# Altium project BatGPSTracker.PrjPcb
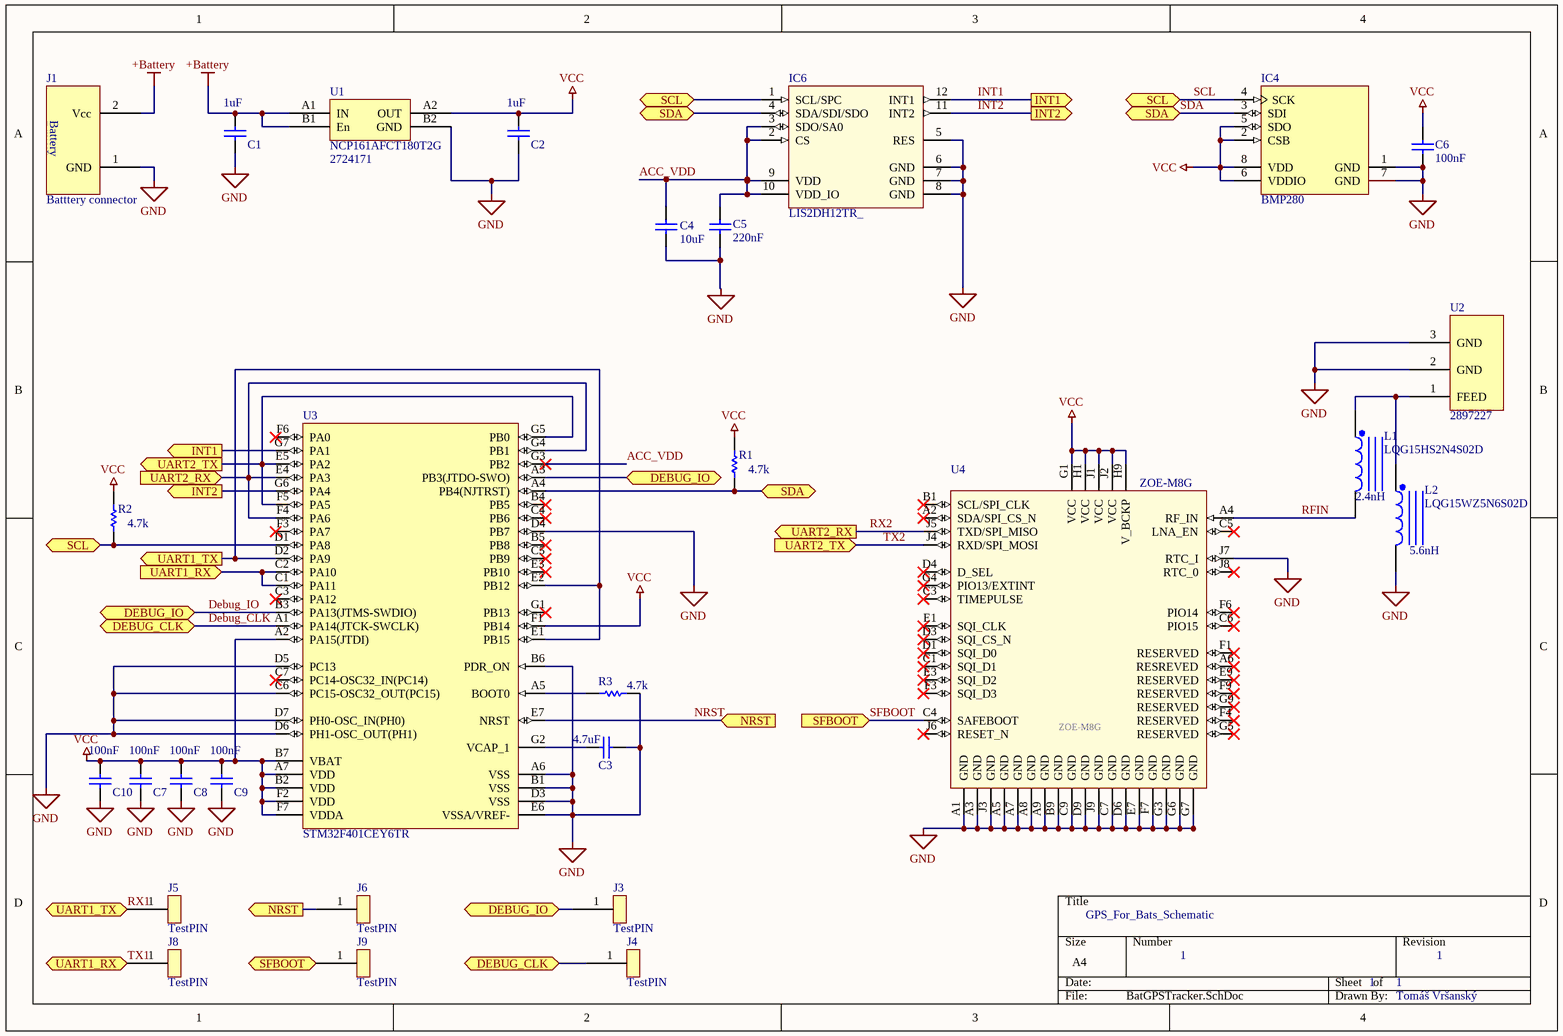
[diagram p0: BatGPSTracker.SchDoc]
projectRevision: 1
1 sheet, 28 parts. Net scope: flat (ports and power ports of the same name join across sheets).

## Sheet BatGPSTracker.SchDoc: GPS_For_Bats_Schematic
size A4; DrawnBy: Tomáš Vršanský; DocumentNumber: 1; Revision: 1; SheetNumber: 1; SheetTotal: 1; DocumentName: BatGPSTracker_Schematic; ProjectName: BatGPSTracker_Schematic

### Parts
C1  value 1uF  [CAPC0402(1005)60_L]  (hidden comment: CAP 1uF 10V 0402(1005))
C2  value 1uF  [CAPC0402(1005)60_L]  (hidden comment: CAP 1uF 10V 0402(1005))
C3  value 4.7uF  [CAPC0402(1005)60_L]  (hidden comment: CAP 4.7uF 16V 0402(1005))
C4  value 10uF  [CAPC0402(1005)60_L]  (hidden comment: CAP 10uF 6.3V 0402(1005))
C5  value 220nF  [CAPC0402(1005)60_L]  (hidden comment: CAP 220nF 6.3V 0402(1005))
C6  value 100nF  [CAPC0402(1005)60_L]  (hidden comment: CAP 100nF 25V 0402(1005))
C7  value 100nF  [CAPC0402(1005)60_L]  (hidden comment: CAP 100nF 10V 0402(1005))
C8  value 100nF  [CAPC0402(1005)60_L]  (hidden comment: CAP 100nF 10V 0402(1005))
C9  value 100nF  [CAPC0402(1005)60_L]  (hidden comment: CAP 100nF 10V 0402(1005))
C10  value 100nF  [CAPC0402(1005)60_L]  (hidden comment: CAP 100nF 10V 0402(1005))
IC4  BMP280  [BOSC-LGA-8_V]
IC6  LIS2DH12TR_  [LGA-12_]
J1  Batttery connector  [PCBCOMPONENT_1]  (no BOM)
J3  TestPIN  (no BOM)
J4  TestPIN  (no BOM)
J5  TestPIN  (no BOM)
J6  TestPIN  (no BOM)
J8  TestPIN  (no BOM)
J9  TestPIN  (no BOM)
L1  LQG15HS2N4S02D  Inductance: 2.4nH  [INDC1005X55X25ML05T10_A]
L2  LQG15WZ5N6S02D  Inductance: 5.6nH  [INDC1005X55X25ML05T10_A]
R1  Resistance (Ohms): 4.7k  [RESC1005X40X25LL10T15]  (hidden comment: RMCF0402JT4K70)
R2  Resistance (Ohms): 4.7k  [RESC1005X40X25LL10T15]  (hidden comment: RMCF0402JT4K70)
R3  Resistance (Ohms): 4.7k  [RESC1005X40X25LL10T15]  (hidden comment: RMCF0402JT4K70)
U1  NCP161AFCT180T2G  Supplier Part Number 1: 2724171  [BGA4C40P2X2_84X84X60N]
U2  Supplier Part Number 1: 2897227  [W3011]  (hidden comment: W3011)
U3  STM32F401CEY6TR  [STM-WLCSP49-3060X3060DE_V]
U4  ZOE-M8G  [ZOE-M8_ZOE-M8G(Primary)]

### Ports
DEBUG_CLK (bidir), DEBUG_IO (bidir), INT1 (out), INT2 (out), NRST (in), NRST (out), SCL (bidir), SDA (bidir), SFBOOT (in), SFBOOT (out), UART1_RX (in), UART1_RX (out), UART1_TX (in), UART1_TX (out), UART2_RX (in), UART2_RX (out), UART2_TX (in), UART2_TX (out)

### Nets
+Battery: C1.2 J1.2(Vcc) U1.A1(IN) U1.B1(En)
GND: C1.1 C2.1 C3.2 C4.1 C5.1 C6.1 C7.1 C8.1 C9.1 C10.1 IC4.1(GND) IC4.7(GND) IC6.5(RES) IC6.6(GND) IC6.7(GND) IC6.8(GND) J1.1(GND) L2.2 R3.1 U1.B2(GND) U2.2(GND) U2.3(GND) U3.A6(VSS) U3.B1(VSS) U3.B6(PDR_ON) U3.C6(PC15-OSC32_OUT(PC15)) U3.D3(VSS) U3.D4(PB7) U3.D5(PC13) U3.D6(PH1-OSC_OUT(PH1)) U3.D7(PH0-OSC_IN(PH0)) U3.E6(VSSA/VREF-) U4.A1(GND) U4.A3(GND) U4.A5(GND) U4.A7(GND) U4.A8(GND) U4.A9(GND) U4.B9(GND) U4.C7(GND) U4.C9(GND) U4.D6(GND) U4.D9(GND) U4.E7(GND) U4.F7(GND) U4.G3(GND) U4.G6(GND) U4.G7(GND) U4.J3(GND) U4.J7(RTC_I) U4.J9(GND)
VCC: C2.2 C6.2 C7.2 C8.2 C9.2 C10.2 IC4.2(CSB) IC4.5(SDO) IC4.6(VDDIO) IC4.8(VDD) R1.2 R2.2 U1.A2(OUT) U3.A2(PA15(JTDI)) U3.A7(VDD) U3.B2(VDD) U3.B7(VBAT) U3.F1(PB14) U3.F2(VDD) U3.F7(VDDA) U4.G1(VCC) U4.H1(VCC) U4.H9(V_BCKP) U4.J1(VCC) U4.J2(VCC)
ACC_VDD: C4.2 C5.2 IC6.2(CS) IC6.3(SDO/SA0) IC6.9(VDD) IC6.10(VDD_IO) U3.G3(PB2)
Debug_CLK: J4.1 U3.A1(PA14(JTCK-SWCLK)) ; port DEBUG_CLK
Debug_IO: J3.1 U3.A3(PB3(JTDO-SWO)) U3.B3(PA13(JTMS-SWDIO)) ; port DEBUG_IO
INT1: IC6.12(INT1) U3.G7(PA1) ; port INT1
INT2: IC6.11(INT2) U3.G6(PA4) ; port INT2
NRST: J6.1 U3.E7(NRST) ; port NRST
RFIN: L1.2 U4.A4(RF_IN)
RX1: J5.1 U3.D2(PA9) U3.E1(PB15) U3.E2(PB12) ; port UART1_TX
RX2: U3.E4(PA3) U3.F4(PA6) U3.G4(PB1) U4.J5(TXD/SPI_MISO) ; port UART2_RX
SCL: IC4.4(SCK) IC6.1(SCL/SPC) R2.1 U3.D1(PA8) ; port SCL
SDA: IC4.3(SDI) IC6.4(SDA/SDI/SDO) R1.1 U3.A4(PB4(NJTRST)) ; port SDA
SFBOOT: J9.1 U4.C4(SAFEBOOT) ; port SFBOOT
TX1: J8.1 U3.C1(PA11) U3.C2(PA10) ; port UART1_RX
TX2: U3.E5(PA2) U3.F5(PA5) U3.G5(PB0) U4.J4(RXD/SPI_MOSI) ; port UART2_TX
NetC3_1: C3.1 U3.G2(VCAP_1)
NetL1_1: L1.1 L2.1 U2.1(FEED)
NetR3_2: R3.2 U3.A5(BOOT0)

Not connected (* = marked no-connect by the designer): U3 B4(PB5)* B5(PB8)* C3(PA12)* C4(PB6)* C5(PB9)* C7(PC14-OSC32_IN(PC14))* E3(PB10)* F3(PA7)* F6(PA0)* G1(PB13)*; U4 A2(SDA/SPI_CS_N)* A6(RESREVED)* B1(SCL/SPI_CLK)* C1(SQI_D1)* C3(TIMEPULSE)* C5(LNA_EN)* C6(PIO15)* D1(SQI_D0)* D3(SQI_CS_N)* D4(D_SEL)* E1(SQI_CLK)* E3(SQI_D2)* E9(RESERVED)* F1(RESERVED)* F3(SQI_D3)* F4(RESERVED)* F6(PIO14)* F9(RESERVED)* G4(PIO13/EXTINT)* G5(RESERVED)* G9(RESERVED)* J6(RESET_N)* J8(RTC_0)*

### Notes on the sheet
- (in symbol Component_1) Battery

### Library data of the parts
C1 C2 C7-C10 = CMP-1034-02118-1: CAP 1uF 10V -20% to +80% 0402 (1005 Metric) Thickness 0.6mm SMD; Case-EIA: 0402; Case-Metric: 1005; Tolerance: -20% to +80%; Max Thickness: 0.6 mm; Rated Voltage: 10 V; Technology: SMT
C3 = CMP-1034-01811-1: CAP 4.7uF 16V ±20% 0402 (1005 Metric) Thickness 0.6mm SMD; Case-EIA: 0402; Tolerance: Â±20%; Case-Metric: 1005; Technology: SMT; Max Thickness: 0.6 mm; Rated Voltage: 16 V; Supplier 1: Farnell; Supplier Part Number 1: 1833801
C4 = CMP-1034-02138-1: CAP 10uF 6.3V ±20% 0402 (1005 Metric) Thickness 0.6mm SMD; Case-Metric: 1005; Case-EIA: 0402; Tolerance: Â±20%; Rated Voltage: 6.3 V; Technology: SMT; Max Thickness: 0.6 mm
C5 = CMP-1034-02085-1: CAP 220nF 6.3V -20% to +80% 0402 (1005 Metric) Thickness 0.6mm SMD; Case-EIA: 0402; Case-Metric: 1005; Technology: SMT; Max Thickness: 0.6 mm; Rated Voltage: 6.3 V; Tolerance: -20% to +80%
C6 = CMP-1034-02073-1: CAP 100nF 25V ±20% 0402 (1005 Metric) Thickness 0.6mm SMD; Tolerance: Â±20%; Case-EIA: 0402; Case-Metric: 1005; Rated Voltage: 25 V; Max Thickness: 0.6 mm; Technology: SMT
IC4 = CMP-2000-05076-1: Digital Pressure Sensor, 1.71 to 3.6 V, -40 to 85 degC, 8-Pin LGA, RoHS, Tape and Reel; Manufacturer: Bosch Sensortec; Manufacturer URL: http://www.bosch-sensortec.com; Datasheet URL: http://datasheet.octopart.com/BMP280-Bosch-datasheet-41546027.pdf; Datasheet Version: Rev. 1.14, 05/2015
IC6 = LIS2DH12TR_: .sch_checked: FALSE; .pcb_checked: FALSE
J1 J3-J6 J8 J9 = Component_1
L1 = CMP-2000-06579-1: Chip Inductor, 2.4 nH, +/- 0.3 nH, 300 mA, -55 to 125 degC, 0402 (1005 Metric), RoHS, Tape and Reel; Manufacturer: MurataElectronics; Core Material: Air; Minimum Quality Factor: 8@100MHz; Tolerance: 0.3nH; Maximum DC Resistance: 150mOhm; Type: RFChip; Maximum DC Current: 300mA; Product Height: 0.55mm; Datasheet URL: http://search.murata.co.jp/Ceramy/image/img/PDF/ENG/L0075S0083LQG15HS.pdf; Mounting Technology: SurfaceMount; Package Reference: 0402; Package Description: 2-Pin Surface Mount Device, Body 1 x 0.5 mm; Category: InductorSurfaceMount; Manufacturer URL: http://www.murata.com/; Package/Case: 0402; Datasheet Version: 09/2010
L2 = CMP-2000-06579-1: Chip Inductor, 5.6 nH, +/- 0.3 nH, 300 mA, -55 to 125 degC, 0402 (1005 Metric), RoHS, Tape and Reel; Manufacturer: MurataElectronics; Core Material: Air; Minimum Quality Factor: 8@100MHz; Tolerance: 0.3nH; Maximum DC Resistance: 150mOhm; Type: RFChip; Maximum DC Current: 300mA; Product Height: 0.55mm; Datasheet URL: http://search.murata.co.jp/Ceramy/image/img/PDF/ENG/L0075S0083LQG15HS.pdf; Mounting Technology: SurfaceMount; Package Reference: 0402; Package Description: 2-Pin Surface Mount Device, Body 1 x 0.5 mm; Category: InductorSurfaceMount; Manufacturer URL: http://www.murata.com/; Package/Case: 0402; Datasheet Version: 09/2010
R1-R3 = CMP-2000-06988-1: Chip Resistor, 4.7 KOhm, +/- 5%, 0.063 W, -55 to 155 degC, 0402 (1005 Metric), RoHS, Tape and Reel; Manufacturer: Stackpole-Electronics-Inc.; Temperature Coefficient: ±100ppm/°C; Power (Watts): 0.063W,1/16W; Tolerance: ±5%; Family: ChipResistor-SurfaceMount; Datasheet Version: 01/2017; Composition: ThickFilm; Operating Temperature: -55°C~155°C; Height: 0.016"(0.40mm); Features: AutomotiveAEC-Q200; Package Reference: 0402; Datasheet URL: https://www.seielect.com/Catalog/SEI-RMCF_RMCP.pdf; Package Description: 2-Pin Surface Mount Device, Body 1 x 0.5 mm; Packaging: Digi-Reel®; Package / Case: 0402(1005Metric); Size / Dimension: 0.039"Lx0.020"W(1.00mmx0.50mm); Category: Resistors; Mounting Technology: SurfaceMount; Number of Terminations: 2; Supplier Device Package: 0402; Manufacturer URL: https://www.seielect.com/; Series: RMCF
U1 = Component_1: 1.8V Regulator; Supplier 1: Farnell
U2 = Component_1: GPS Chip antenna; Supplier 1: Farnell
U3 = CMP-0243-00142-1: ARM Cortex-M4 32-bit MCU+FPU, 512 KB Flash, 96 KB Internal RAM, 36 I/Os, 49-Pin WLCSP, -40 to 85 degC, Tape and Reel; Operating Frequency(F) (Processor speed) (MHz): 84; I/Os (High Current): 36; FLASH Size (Prog) (kB): 512; Internal RAM Size (kB): 96; Supply Voltage(Vcc) min (V): 1.7; Mounting Technology: Surface Mount; Package Description: WLCSP49-3060X3060DE; ComponentLink2URL: http://www.st.com/st-web-ui/static/active/en/resource/technical/document/datasheet/DM00102166.pdf; Packing: Tape and Reel; Package Reference: 49-Ball Wafer Level Chip Scale Package, 3.029 x 3.029 mm Body, 0.4 mm Pitch; ComponentLink1URL: http://www.st.com/; Core: ARM Cortex-M4; DatasheetVersion: Rev. 3; ComponentLink1Description: Manufacturer URL; ComponentLink2Description: Datasheet
U4 = ZOE-M8G: M8 Concurrent Gnss Module; MF: u-blox; Package: SMD-51 u-blox; Price: None; MP: ZOE-M8G; Availability: Unavailable; SnapEDA_Link: https://www.snapeda.com/parts/ZOE-M8G/u-blox/view-part/?ref=snap; Value: *

## Assembly variants
Main: all parts fitted
WithoutRFMatching: not fitted L2